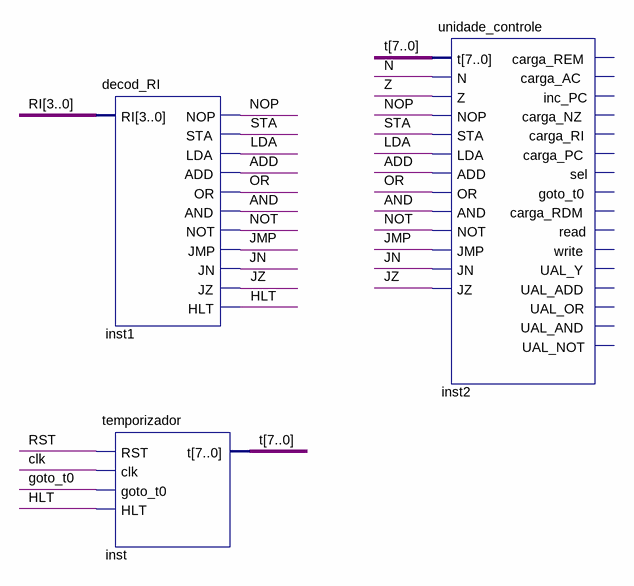
[diagram p0: schematic sheet]
// Quartus schematic LAB9.bdf as structural Verilog: 3 symbols, 0 pins
module LAB9 (
);

  wire ADD, AND, clk, goto_t0, HLT, JMP, JN, JZ, LDA, N, NOP, NOT, OR, RST, STA, Z;
  wire [3:0] RI;
  wire [7:0] t;

  decod_RI inst1 (
    .RI(RI), .NOP(NOP), .STA(STA), .LDA(LDA), .ADD(ADD), .OR(OR), .AND(AND), .NOT(NOT), .JMP(JMP), .JN(JN),
    .JZ(JZ), .HLT(HLT));
  temporizador inst (.RST(RST), .clk(clk), .goto_t0(goto_t0), .HLT(HLT), .t(t));
  unidade_controle inst2 (
    .t(t), .N(N), .Z(Z), .NOP(NOP), .STA(STA), .LDA(LDA), .ADD(ADD), .OR(OR), .AND(AND), .NOT(NOT),
    .JMP(JMP), .JN(JN), .JZ(JZ));  // open: carga_REM, carga_AC, inc_PC, carga_NZ, carga_RI, carga_PC, sel, goto_t0, carga_RDM, read, write, UAL_Y, UAL_ADD, UAL_OR, UAL_AND, UAL_NOT
endmodule
